# Altium schematic sheet PreDAQ_Filter.SchDoc
size A4; SheetNumber: 4; SheetTotal: 7
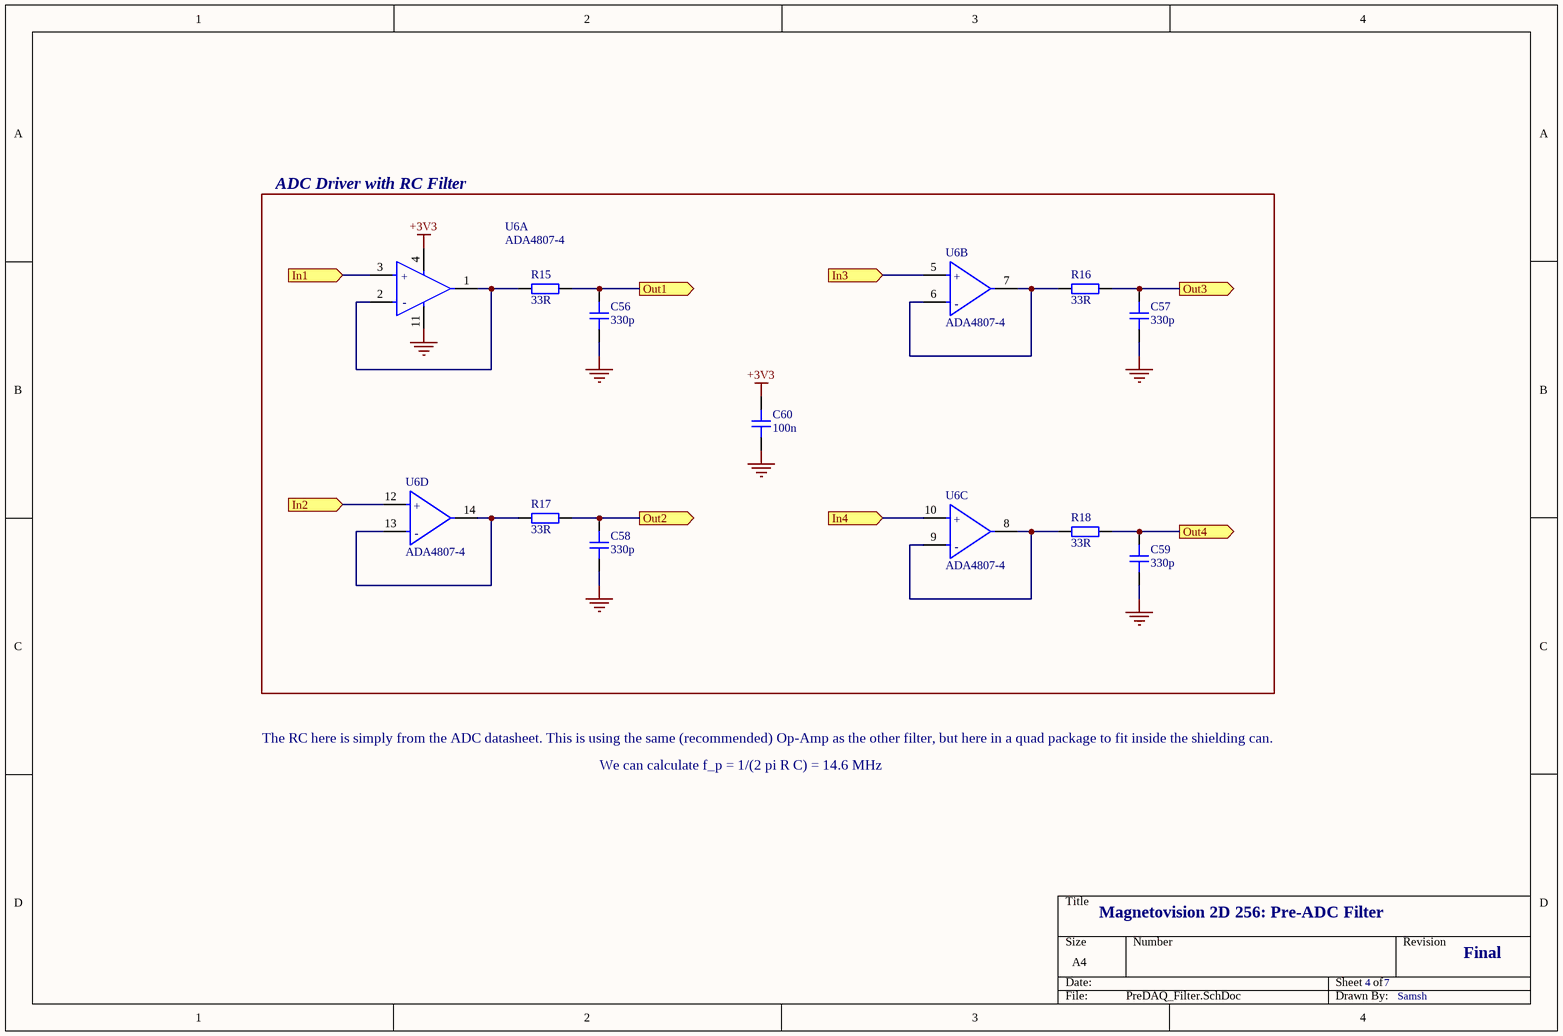
[diagram p0: PreDAQ_Filter.SchDoc]

## Parts
C56  330p  [CAP_0603]
C57  330p  [CAP_0603]
C58  330p  [CAP_0603]
C59  330p  [CAP_0603]
C60  100n  [CAP_0603]
R15  33R  [RES_0603]
R16  33R  [RES_0603]
R17  33R  [RES_0603]
R18  33R  [RES_0603]
U6  ADA4807-4  [FP-RU-14-IPC_A]  (parts A,B,C,D of 4)

## Blocks framed on the sheet
ADC Driver with RC Filter: C56-C60 R15-R18 U6

## Ports
In1 (in, see DAQ[2C]), In2 (in, see DAQ[1C]), In3 (in, see DAQ[2C]), In4 (in, see DAQ[1C]), Out1 (out, see DAQ[2C]), Out2 (out, see DAQ[1C]), Out3 (out, see DAQ[2C]), Out4 (out, see DAQ[1C])

## Nets
+3V3: C60.2 U6.4(+VS)
GND: C56.1 C57.1 C58.1 C59.1 C60.1 U6.11(-VS)
In1: U6.3(+IN1) ; port In1
In2: U6.12(+IN4) ; port In2
In3: U6.5(+IN2) ; port In3
In4: U6.10(+IN3) ; port In4
Out1: C56.2 R15.1 ; port Out1
Out2: C58.2 R17.1 ; port Out2
Out3: C57.2 R16.1 ; port Out3
Out4: C59.2 R18.1 ; port Out4
NetR15_2: R15.2 U6.1(VOUT1) U6.2(-IN1)
NetR16_2: R16.2 U6.6(-IN2) U6.7(VOUT2)
NetR17_2: R17.2 U6.13(-IN4) U6.14(VOUT4)
NetR18_2: R18.2 U6.8(VOUT3) U6.9(-IN3)

## Notes on the sheet
- The RC here is simply from the ADC datasheet. This is using the same (recommended) Op-Amp as the other filter, but here in a quad package to fit inside the shielding can.
- We can calculate f_p = 1/(2 pi R C) = 14.6 MHz
- Magnetovision 2D 256: Pre-ADC Filter
- 4
- 7
- Final
- Samsh
- (in symbol CMP-09116-000241-1, part A) +; -
- (in symbol CMP-09116-000241-1, part B) +; -
- (in symbol CMP-09116-000241-1, part C) +; -
- (in symbol CMP-09116-000241-1, part D) +; -

## Library data of the parts
C56-C60 = CMP-001-00085-1: Capacitor SMD 0603; Distributor Link: *; LCSC: *; Design Item ID: CAP_0603; Rating: *; Source: Schematic-Lib-PhilsLab.SchLib; Manufacturer Part Number: *; Manufacturer: *; Dielectric: *
R15-R18 = CMP-009-00179-1: Resistor SMD 0603; Manufacturer Part Number: *; Distributor Link: *; Source: Schematic-Lib-PhilsLab.SchLib; Manufacturer: *; Design Item ID: RES_0603; LCSC: *
U6 = CMP-09116-000241-1: IC OPAMP VFB 4 CIRCUIT 14TSSOP; Input Bias Current: 1.2uA; Min Supply Voltage: 2.7V; -3db Bandwidth: 180MHz; Number of Circuits: 4; Gain Bandwidth Product: 170MHz; Dual Supply Voltage: 5V; Power Supply Rejection Ratio (PSRR): 98dB; Common Mode Rejection Ratio: 96dB; Output Current per Channel: 80mA; Input Offset Voltage (Vos): 140uV; Voltage Gain: 130dB; Slew Rate: 225V/µs; Max Supply Voltage: 11V; Operating Supply Current: 1mA; Lead Free: Contains Lead; Number of Pins: 14; Packaging: Rail/Tube; Mount: Surface Mount; Bandwidth: 180MHz; RoHS Compliant: Yes; Max Operating Temperature: 125°C; Min Operating Temperature: -40°C; Number of Amplifiers: 4; REACH SVHC: No SVHC; Case/Package: TSSOP